# EAGLE design mega (EAGLE 9.2.2)
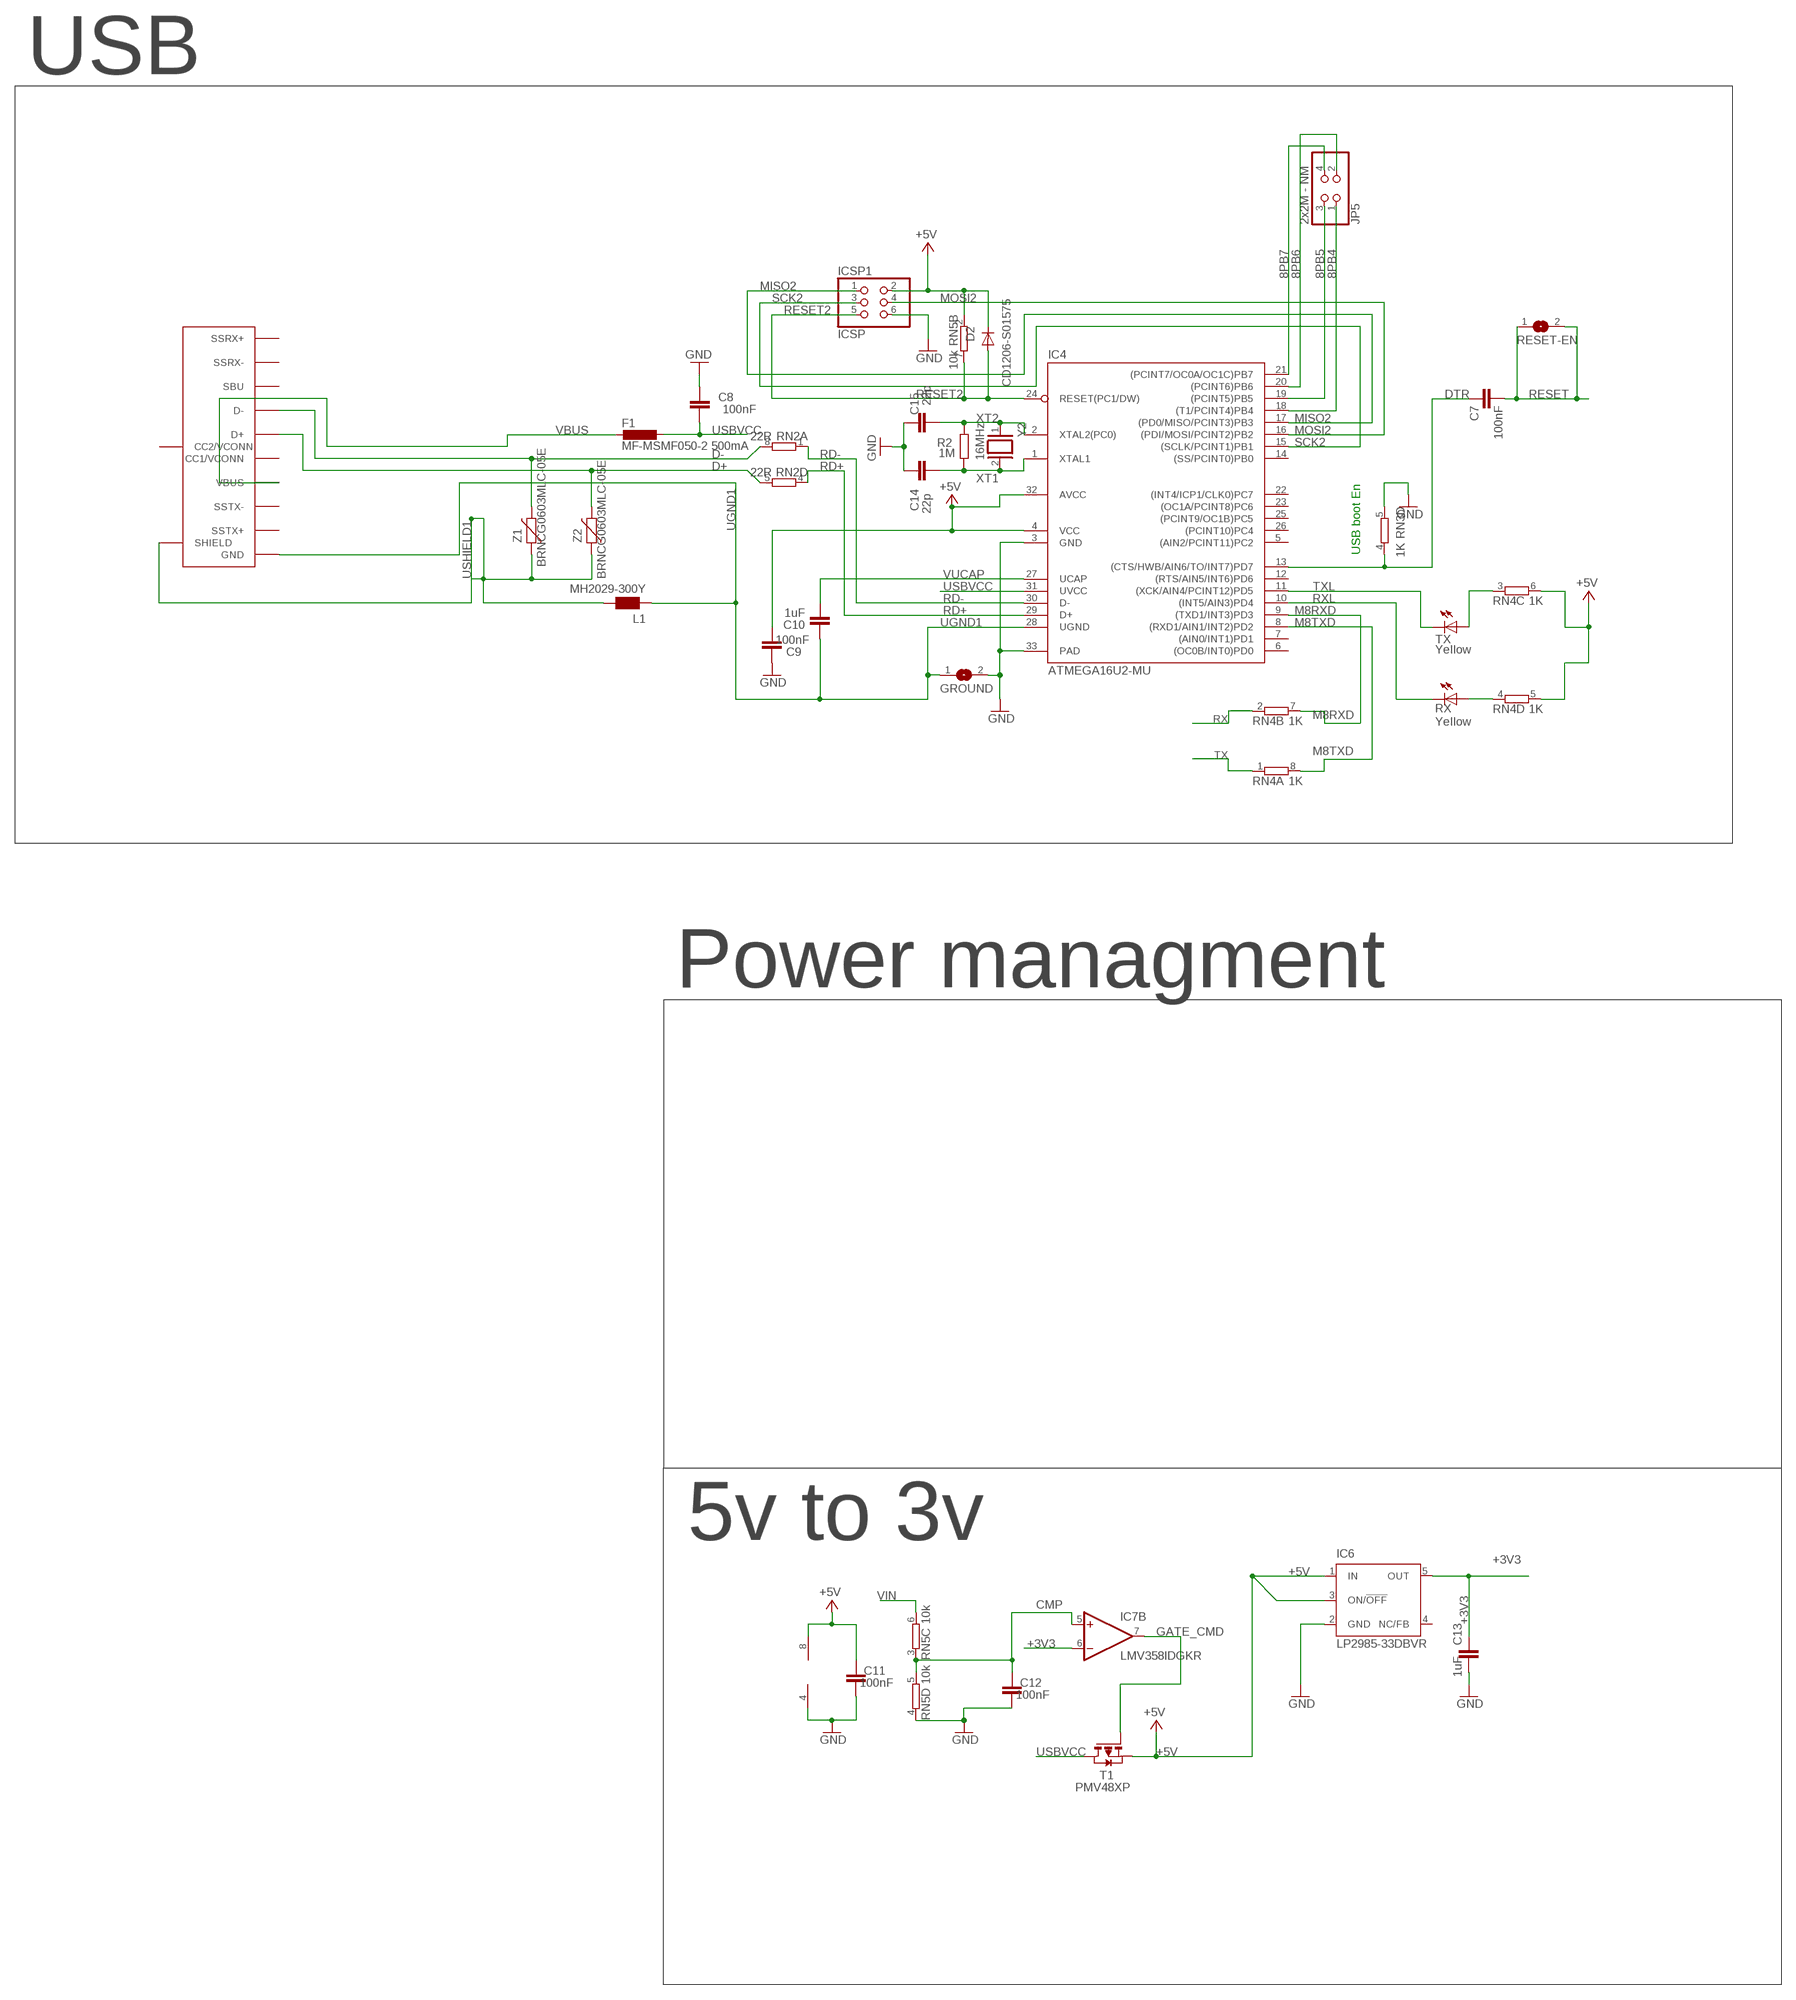
[diagram p0: schematic, sheet 1, part 1 of 2]
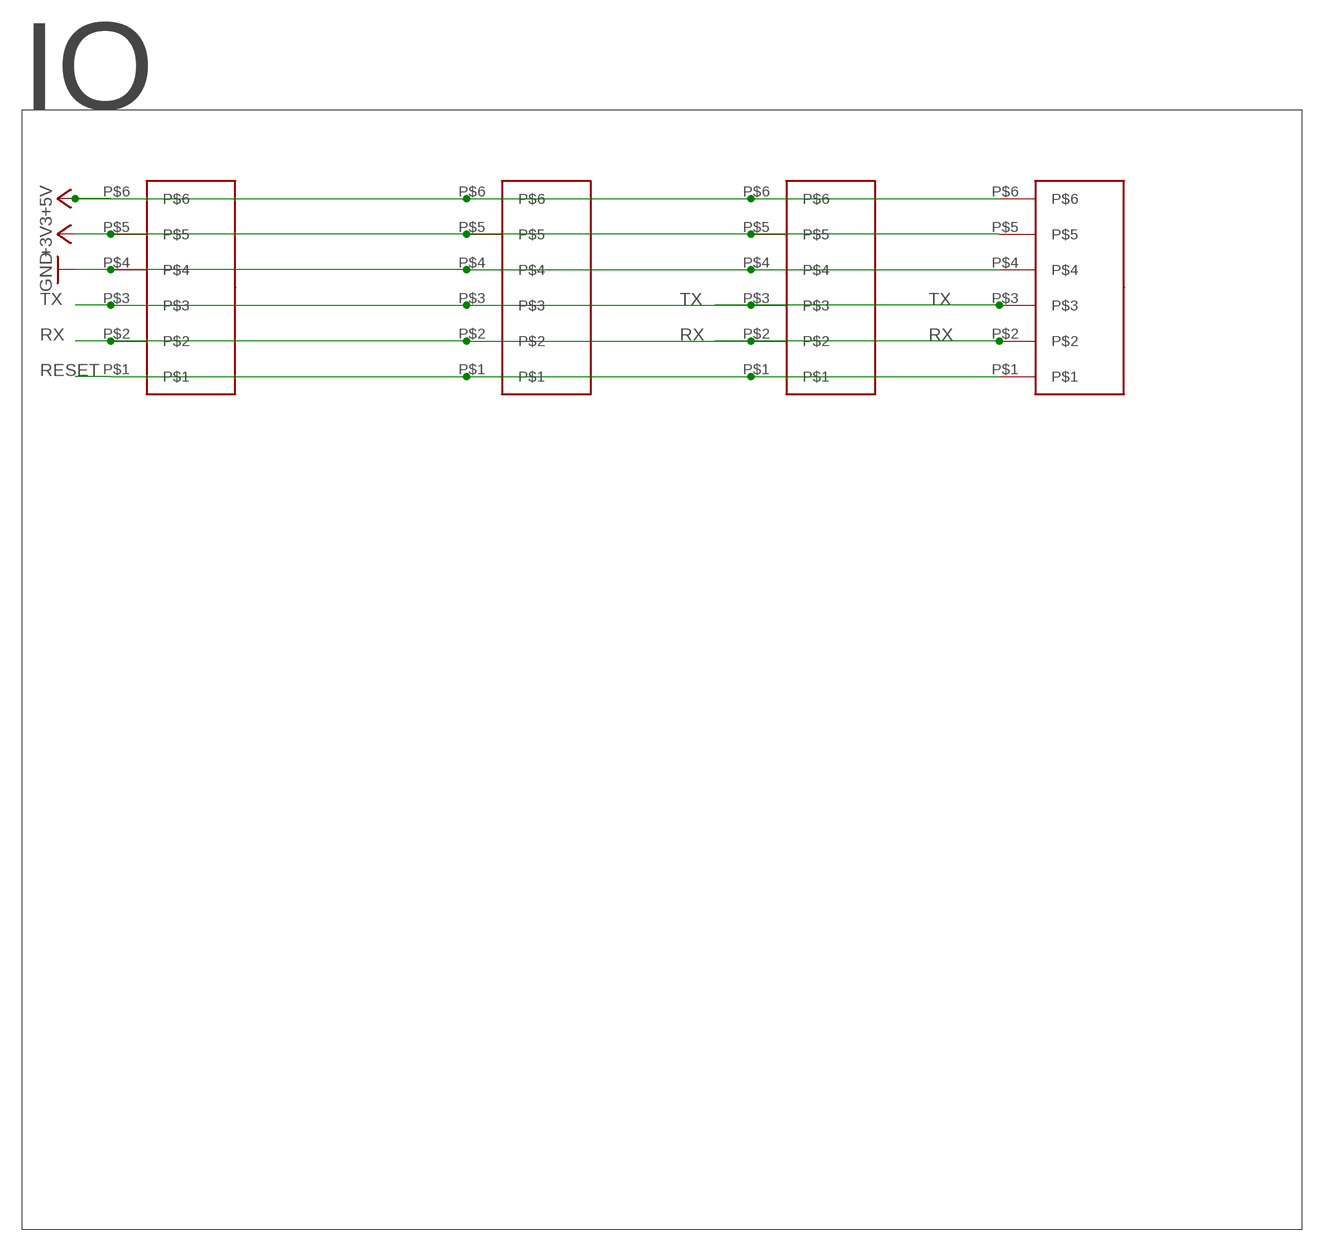
[diagram p1: schematic, sheet 1, part 2 of 2]

## Parts
C7  100nF  0015_100NF_0603  [C0603-ROUND]
C8  100nF  0015_100NF_0603  [C0603-ROUND]
C9  100nF  0015_100NF_0603  [C0603-ROUND]
C10  1uF  0006_1UF_0603/GRM188R61E105KA12D  [C0603-ROUND]
C11  100nF  0015_100NF_0603  [C0603-ROUND]
C12  100nF  0015_100NF_0603  [C0603-ROUND]
C13  1uF  0006_1UF_0603/GRM188R61E105KA12D  [C0603-ROUND]
C14  22p  0014_22PF_0603  [C0603-ROUND]
C15  22p  0014_22PF_0603  [C0603-ROUND]
D2  CD1206-S01575  0012_CD1206-S01575  [MINIMELF]
F1  MF-MSMF050-2 500mA  0002_MF-MSMF050-2  [L1812]
GROUND  SJ  [SJ]
IC4  ATMEGA16U2-MU  0007_ATMEGA16U2-MUR  [MLF32]
IC6  LP2985-33DBVR  0008_TEXLP2985-33DBVR  [SOT23-DBV]
IC7  LMV358IDGKR  0021_LMV358IDGKR  [MSOP08]
ICSP1  ICSP  0114_PH254-203DF118A00V  [2X03]
JP5  2x2M - NM  PINHD-2X2  [2X02]
L1  MH2029-300Y  0001_BLM21PG300SN1D_/_MH2029-300Y  [0805]
R2  1M  0004_0603_1M  [R0603-ROUND]
RESET-EN  SJ  [SJ]
RN2  22R  0003_064R_22R_/_CAY16-220J4LF  [CAY16]
RN3  1K  0005_064R_1K_/_CAY16-102J4LF  [CAY16]
RN4  1K  0005_064R_1K_/_CAY16-102J4LF  [CAY16]
RN5  10k  0016_064R_10K_/_CAY16-103J4LF  [CAY16]
RX  Yellow  0044_KPT-2012YC  [CHIPLED_0805]
T1  PMV48XP  0297_PMV48XP  [SOT-23]
TX  Yellow  0044_KPT-2012YC  [CHIPLED_0805]
U$1  USB-TYPE-C  [USB-TYPE-C-SMT]
U$2  6PINHERM  [6PINHERMSMD]
U$3  6PINHERM  [6PINHERMSMD]
U$4  6PINHERM  [6PINHERMSMD]
U$5  6PINHERM  [6PINHERMSMD]
Y2  16MHz  0019_P011052006_16M  [QS]
Z1  BRNCG0603MLC-05E  0010_BRNCG0603MLC-05E  [CT/CN0603]
Z2  BRNCG0603MLC-05E  0010_BRNCG0603MLC-05E  [CT/CN0603]

## Nets
8PB4: IC4.18((T1/PCINT4)PB4) JP5.1
8PB5: IC4.19((PCINT5)PB5) JP5.3
8PB6: IC4.20((PCINT6)PB6) JP5.2
8PB7: IC4.21((PCINT7/OC0A/OC1C)PB7) JP5.4
+3V3 [power]: C13.2 IC6.5(OUT) IC7.6(B:-IN) U$2.P$5 U$3.P$5 U$4.P$5 U$5.P$5
+5V [power usb]: C9.1 C11.2 D2.C IC4.4(VCC) IC4.32(AVCC) IC6.1(IN) IC6.3(ON/!OFF) IC7.8(P:V+) ICSP1.2 RN4.5 RN4.6 RN5.2 T1.2(S) U$2.P$6 U$3.P$6 U$4.P$6 U$5.P$6
CMP: C12.2 IC7.5(B:+IN) RN5.3 RN5.5
D+: RN2.5 U$1.6(D+) U$1.B6(D+) Z2.2
D-: RN2.8 U$1.7(D-) U$1.B7(D-) Z1.2
DTR: C7.1 IC4.13((CTS/HWB/AIN6/TO/INT7)PD7) RN3.4
GATE_CMD: IC7.7(B:OUT) T1.3(G)
GND [gnd]: C8.2 C9.2 C11.1 C12.1 C13.1 C14.2 C15.2 GROUND.2 IC4.3(GND) IC4.33(PAD) IC6.2(GND) IC7.4(P:V-) ICSP1.6 RN3.5 RN5.4 U$2.P$4 U$3.P$4 U$4.P$4 U$5.P$4
M8RXD: IC4.9((TXD1/INT3)PD3) RN4.7
M8TXD: IC4.8((RXD1/AIN1/INT2)PD2) RN4.8
MISO2: IC4.17((PD0/MISO/PCINT3)PB3) ICSP1.1
MOSI2: IC4.16((PDI/MOSI/PCINT2)PB2) ICSP1.4
N$54: RN4.4 RX.A
N$55: RN4.3 TX.A
RD+: IC4.29(D+) RN2.4
RD-: IC4.30(D-) RN2.1
RESET: C7.2 RESET-EN.1 RESET-EN.2 U$2.P$1 U$3.P$1 U$4.P$1 U$5.P$1
RESET2: D2.A IC4.24(RESET(PC1/DW)) ICSP1.5 RN5.7
RX: RN4.2 U$2.P$2 U$3.P$2 U$4.P$2 U$5.P$2
RXL: IC4.10((INT5/AIN3)PD4) RX.C
SCK2: IC4.15((SCLK/PCINT1)PB1) ICSP1.3
TX: RN4.1 U$2.P$3 U$3.P$3 U$4.P$3 U$5.P$3
TXL: IC4.11((XCK/AIN4/PCINT12)PD5) TX.C
UGND1 [gnd]: C10.2 GROUND.1 IC4.28(UGND) L1.1 U$1.1(GND) U$1.12(GND) U$1.B1(GND) U$1.B12(GND)
USBVCC [power usb]: C8.1 F1.1 IC4.31(UVCC) T1.1(D)
USHIELD1 [gnd]: L1.2 U$1.P$1(SHIELD) U$1.P$2(SHIELD) U$1.P$3(SHIELD) U$1.P$4(SHIELD) U$1.P$5(SHIELD) U$1.P$6(SHIELD) U$1.P$7(SHIELD) U$1.P$8(SHIELD) U$1.P$9(SHIELD) U$1.P$10(SHIELD) U$1.P$11(SHIELD) U$1.P$12(SHIELD) U$1.P$13(SHIELD) U$1.P$14(SHIELD) U$1.P$15(SHIELD) U$1.P$16(SHIELD) U$1.P$17(SHIELD) U$1.P$18(SHIELD) U$1.P$19(SHIELD) U$1.P$20(SHIELD) U$1.P$21(SHIELD) U$1.P$22(SHIELD) U$1.P$23(SHIELD) U$1.P$24(SHIELD) U$1.P$25(SHIELD) U$1.P$26(SHIELD) U$1.P$27(SHIELD) U$1.P$28(SHIELD) Z1.1 Z2.1
VBUS [power usb]: F1.2 U$1.4(VBUS) U$1.9(VBUS) U$1.B4(VBUS) U$1.B9(VBUS)
VIN [power]: RN5.6
VUCAP: C10.1 IC4.27(UCAP)
XT1: C14.1 IC4.1(XTAL1) R2.1 Y2.2
XT2: C15.1 IC4.2(XTAL2(PC0)) R2.2 Y2.1
Unconnected: IC4.5((AIN2/PCINT11)PC2) IC4.6((OC0B/INT0)PD0) IC4.7((AIN0/INT1)PD1) IC4.12((RTS/AIN5/INT6)PD6) IC4.14((SS/PCINT0)PB0) IC4.22((INT4/ICP1/CLK0)PC7) IC4.23((OC1A/PCINT8)PC6) IC4.25((PCINT9/OC1B)PC5) IC4.26((PCINT10)PC4) IC6.4(NC/FB) IC7.1(A:OUT) IC7.2(A:-IN) IC7.3(A:+IN) RN2.2 RN2.3 RN2.6 RN2.7 RN3.1 RN3.2 RN3.3 RN3.6 RN3.7 RN3.8 RN5.1 RN5.8 U$1.2(SSTX+) U$1.3(SSTX-) U$1.5(CC1/VCONN) U$1.8(SBU) U$1.10(SSRX-) U$1.11(SSRX+) U$1.B2(SSTX+) U$1.B3(SSTX-) U$1.B5(CC2/VCONN) U$1.B8(SBU) U$1.B10(SSRX-) U$1.B11(SSRX+)

## Notes on the sheet
- USB | IO
- USB boot En
- Power managment
- 5v to 3v

## Library data of the parts
C7-C9 C11 C12 = Condensatori:0015_100NF_0603: 100nF 0603 50V; CASE: 0603; MONTHLY_USAGE: _____; PART_NUMBER: cl10b104kbnc; PRICE: _____; SUPPLIER: _____; TYPE: Condensatori
C10 C13 = Condensatori:0006_1UF_0603/GRM188R61E105KA12D: 1uF 0603; CASE: 0603; MONTHLY_USAGE: _____; PART_NUMBER: 1uF_0603/GRM188R61E105KA12D; PRICE: _____; SUPPLIER: _____; TYPE: Condensatori
C14 C15 = Condensatori:0014_22PF_0603: 22pF 0603; CASE: 0603; MONTHLY_USAGE: _____; PART_NUMBER: 22pF_0603; PRICE: _____; SUPPLIER: _____; TYPE: Condensatori
D2 = Diodi:0012_CD1206-S01575: small-signal high-speed Switching Diodes CD1206; CASE: 1206; MONTHLY_USAGE: _____; PART_NUMBER: CD1206-S01575; PRICE: _____; SUPPLIER: _____; TYPE: Diodi
F1 = Protezione:0002_MF-MSMF050-2: 500 mA Multifuse � Polyfuse; MONTHLY_USAGE: _____; PART_NUMBER: MF-MSMF050-2; PRICE: _____; SUPPLIER: _____; TYPE: Protezione
GROUND RESET-EN = jumper:SJ: SMD solder JUMPER
IC4 = IntegratedCircuits:0007_ATMEGA16U2-MUR: 8-bit Microcontroller with 16K Bytes of ISP Flash and USB Controller ATMEGA16U2-MUR; CASE: QFN32_5x5; MONTHLY_USAGE: _____; PART_NUMBER: ATMEGA16U2-MUR; PRICE: _____; SUPPLIER: _____; TYPE: Circuito_Integrato
IC6 = IntegratedCircuits:0008_TEXLP2985-33DBVR: 150-mA LOW-NOISE LOW-DROPOUT REGULATOR WITH SHUTDOWN LP2985-33DBVR; CASE: SOT23-5; MONTHLY_USAGE: _____; PART_NUMBER: TEXLP2985-33DBVR; PRICE: _____; SUPPLIER: _____; TYPE: Circuito_Integrato
IC7 = IntegratedCircuits:0021_LMV358IDGKR: Dual low-voltage (2.7 V to 5.5 V), operational amplifiers with rail-to-rail output swing LMV358IDGKR; CASE: MSOP8; MONTHLY_USAGE: _____; PART_NUMBER: LMV358IDGKR; PRICE: _____; SUPPLIER: _____; TYPE: Circuito_Integrato
ICSP1 = Connettori:0114_PH254-203DF118A00V: 3x2 M V h 8,5 mm p2,54; MONTHLY_USAGE: _____; PART_NUMBER: PH254-203DF118A00V; PRICE: _____; SUPPLIER: _____; TYPE: Connettori
JP5 = SmartPrj:PINHD-2X2: PIN HEADER
L1 = Protezione:0001_BLM21PG300SN1D_/_MH2029-300Y: BLM21; MONTHLY_USAGE: _____; PART_NUMBER: BLM21PG300SN1D_/_MH2029-300Y; PRICE: _____; SUPPLIER: _____; TYPE: Protezione
R2 = Resistenze:0004_0603_1M: 1M 0603; CASE: 0603; MONTHLY_USAGE: _____; PART_NUMBER: 0603_1M; PRICE: _____; SUPPLIER: _____; TYPE: Resistenze
RN2 = Resistenze:0003_064R_22R_/_CAY16-220J4LF: 22R 064R; CASE: SMD_3,2x1,6; MONTHLY_USAGE: _____; PART_NUMBER: 064R_22R_/_CAY16-220J4LF; PRICE: _____; SUPPLIER: _____; TYPE: Resistenze
RN3 RN4 = Resistenze:0005_064R_1K_/_CAY16-102J4LF: 1K 064R; CASE: SMD_3,2x1,6; MONTHLY_USAGE: _____; PART_NUMBER: 064R_1K_/_CAY16-102J4LF; PRICE: _____; SUPPLIER: _____; TYPE: Resistenze
RN5 = Resistenze:0016_064R_10K_/_CAY16-103J4LF: 10K 064 R; CASE: SMD_3,2x1,6; MONTHLY_USAGE: _____; PART_NUMBER: 064R_10K_/_CAY16-103J4LF; PRICE: _____; SUPPLIER: _____; TYPE: Resistenze
RX TX = Opto:0044_KPT-2012YC: LED YELLOW - SMD - 0805; MONTHLY_USAGE: _____; PART_NUMBER: KPT-2012YC; PRICE: _____; SUPPLIER: _____; TYPE: Opto
T1 = Transistors:0297_PMV48XP: 20 V, 3.5 A P-channel Trench MOSFET - PMV48XP; CASE: SOT23; MONTHLY_USAGE: _____; PART_NUMBER: PMV48XP; PRICE: _____; SUPPLIER: _____; TYPE: Transistor
U$1 = lio:USB-TYPE-C
U$2-U$5 = te_conectivity_6_pin_herm:6PINHERM: https://www.mouser.com/ProductDetail/TE-Connectivity/2213611-3?qs=sGAEpiMZZMsg%252bek5lc7F5uB08Utn55q4E3YUmFQRoIY%3d
Y2 = Cristalli:0019_P011052006_16M: 16MHz THT; PART_NUMBER: P011052006 16M/FTX16M20S; TYPE: Cristalli
Z1 Z2 = Protezione:0010_BRNCG0603MLC-05E: CG0603MLC-05E; MONTHLY_USAGE: _____; PART_NUMBER: BRNCG0603MLC-05E; PRICE: _____; SUPPLIER: _____; TYPE: Protezione

## Net classes
0 default: width 0.203 mm, drill 0.406 mm, clearance 0.203 mm
1 power: width 0.61 mm, drill 0.406 mm, clearance 0.203 mm
2 gnd: width 0.305 mm, drill 0.406 mm, clearance 0.203 mm
3 power usb: width 0.508 mm, drill 0.406 mm, clearance 0.203 mm

## Board
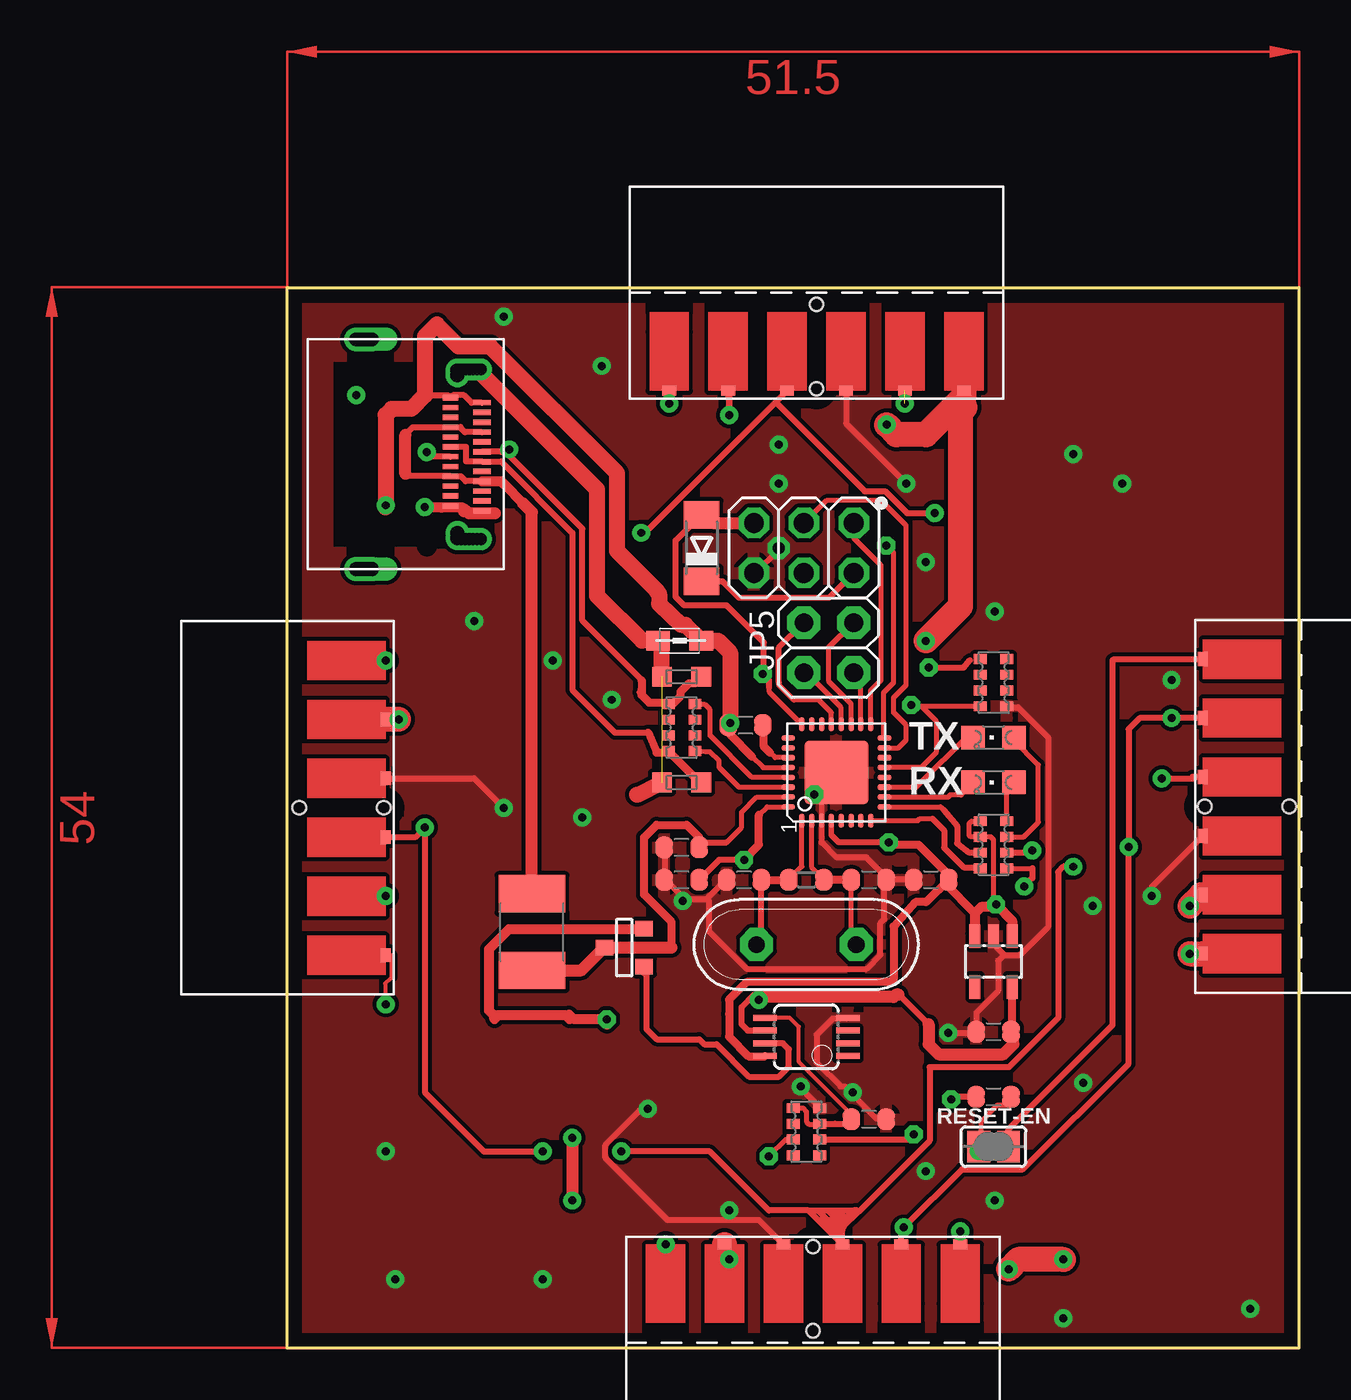
[diagram p2: board, top side]
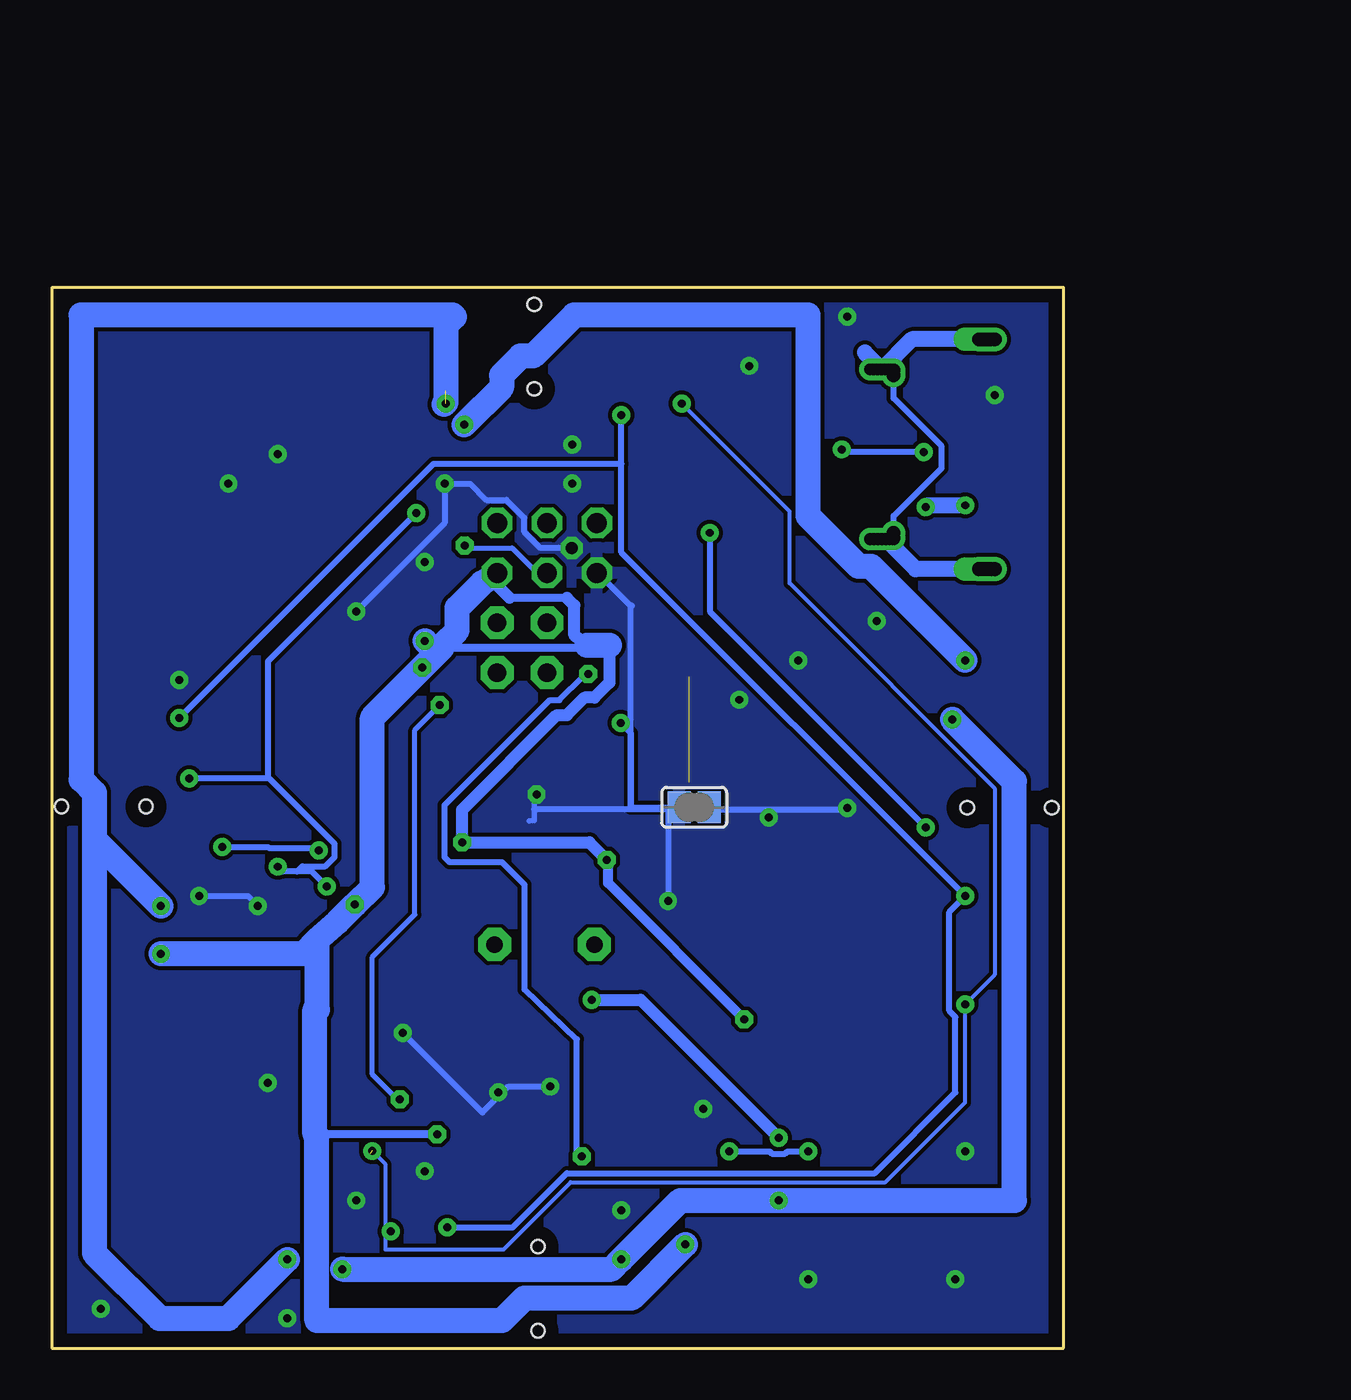
[diagram p3: board, bottom side, seen from below]

Size 51.5 x 54 mm. Coordinates in mm from the lower left corner, seen from the top.
Outline: 0,54 51.5,54 51.5,0 0,0 0,54
Copper layers (1*16): Top 0.035mm / dielectric 1.5mm / Bottom 0.035mm
Design rules "ArduinoMega *": minimum track width 8mil, minimum drill 16mil, track to track 7mil, track to pad 7mil, pad to pad 8mil, via to via 10mil, smd to smd 7mil, copper to edge 27mil, drill to drill 12mil, minimum pad ring 10mil, minimum via ring 10mil, stop-mask expansion 2mil, vias tented up to drill 24mil, thermal gap 10mil

### Footprints (pad centres in the part's own frame; a part is rotated, then mirrored left to right if it is on the bottom)
C0603-ROUND = smd 0.898 x 1.1: 1 -0.889,0; 2 0.889,0
MINIMELF = smd 1.4 x 1.8: A 1.7,0; C -1.7,0
L1812 = smd 1.9 x 3.4: 1 -1.95,0; 2 1.95,0
SJ = smd 1.168 x 1.6: 1 -0.762,0; 2 0.762,0
MLF32 = smd 0.7 x 0.28: 1 -2.45,1.75; 2 -2.45,1.25; 3 -2.45,0.75; 4 -2.45,0.25; 5 -2.45,-0.25; 6 -2.45,-0.75; 7 -2.45,-1.25; 8 -2.45,-1.75; 17 2.45,-1.75; 18 2.45,-1.25; 19 2.45,-0.75; 20 2.45,-0.25; 21 2.45,0.25; 22 2.45,0.75; 23 2.45,1.25; 24 2.45,1.75 | smd 0.28 x 0.7: 9 -1.75,-2.45; 10 -1.25,-2.45; 11 -0.75,-2.45; 12 -0.25,-2.45; 13 0.25,-2.45; 14 0.75,-2.45; 15 1.25,-2.45; 16 1.75,-2.45; 25 1.75,2.45; 26 1.25,2.45; 27 0.75,2.45; 28 0.25,2.45; 29 -0.25,2.45; 30 -0.75,2.45; 31 -1.25,2.45; 32 -1.75,2.45 | smd 3.254 x 3.254: 33 0,0
SOT23-DBV = smd 0.55 x 1.2: 1 -0.95,-1.3; 2 0,-1.3; 3 0.95,-1.3; 4 0.95,1.3; 5 -0.95,1.3
MSOP08 = smd 0.3 x 1.2: 1 -0.976,-2.113; 2 -0.326,-2.113; 3 0.324,-2.113; 4 0.974,-2.113; 5 0.974,2.112; 6 0.324,2.112; 7 -0.326,2.112; 8 -0.976,2.112
2X03 = drill 1.016 pad 1.55 octagon: 1 -2.54,-1.27; 2 -2.54,1.27; 3 0,-1.27; 4 0,1.27; 5 2.54,-1.27; 6 2.54,1.27
2X02 = drill 0.95 pad 1.676 octagon: 1 -1.27,-1.27; 2 -1.27,1.27; 3 1.27,-1.27; 4 1.27,1.27
0805 = smd 1.2 x 1: 1 -1.1,0; 2 1.1,0
R0603-ROUND = smd 0.898 x 1.1: 1 -0.889,0; 2 0.889,0
CAY16 = smd 0.5 x 0.65: 1 -1.2,-0.675; 2 -0.4,-0.675; 3 0.4,-0.675; 4 1.2,-0.675; 5 1.2,0.675; 6 0.4,0.675; 7 -0.4,0.675; 8 -1.2,0.675
CHIPLED_0805 = smd 1.2 x 1.2: A 0,-1.05; C 0,1.05
SOT-23 = smd 0.787 x 0.889: 1 0.025,-1.016; 2 -0.94,1.016; 3 0.991,1.016
USB-TYPE-C-SMT = smd 0.27 x 0.9: 1 -2.625,0.7; 2 -2.125,0.7; 3 -1.625,0.7; 4 -1.125,0.7; 5 -0.625,0.7; 6 -0.125,0.7; 7 0.375,0.7; 8 0.875,0.7; 9 1.375,0.7; 10 1.875,0.7; 11 2.375,0.7; 12 2.875,0.7 | smd 0.27 x 0.8: B1 2.625,-0.9; B2 2.125,-0.9; B3 1.625,-0.9; B4 1.125,-0.9; B5 0.625,-0.9; B6 0.125,-0.9; B7 -0.375,-0.9; B8 -0.875,-0.9; B9 -1.375,-0.9; B10 -1.875,-0.9; B11 -2.375,-0.9; B12 -2.875,-0.9 | drill 0.6: P$1 -4.32,0.25; P$2 4.32,0.65; P$3 -4.32,0.65; P$4 -4.32,0.45; P$7 -4.32,-0.35; P$8 -4.32,0.05; P$9 -4.32,-0.15; P$10 4.32,0.45; P$11 4.32,0.25; P$12 4.32,0.05; P$13 4.32,-0.15; P$14 4.32,-0.35 | drill 0.7 offset: P$5 5.85,-5.4; P$23 -5.85,-5.4 | drill 0.7: P$6 -5.85,-5.3; P$15 4.27,-0.55; P$16 -4.02,-0.55; P$17 -4.27,-0.55; P$18 4.02,-0.55; P$19 -5.85,-5.7; P$20 -5.85,-5.5; P$21 -5.85,-5.1; P$22 -5.85,-4.9; P$24 5.85,-5.7; P$25 5.85,-5.5; P$26 5.85,-5.3; P$27 5.85,-5.1; P$28 5.85,-4.9
6PINHERMSMD = smd 0.5 x 0.7: P$1 -5,17; P$2 -5,14; P$3 -5,11; P$4 -5,8; P$5 -5,5; P$6 -5,2 | hole 0.65: -4.9,9.5; -0.6,9.5 | hole 0.7: -4.9,9.5; -0.6,9.5
QS = drill 0.85 pad 1.676 octagon: 1 -2.54,0; 2 2.54,0
CT/CN0603 = smd 1 x 1: 1 -1,0; 2 1,0

### Placement (x,y rotation side)
C7  35.95,12.8 0 top
C8  20.08,25.5 180 top
C9  20.08,23.85 180 top
C10  23.33,31.72 180 top
C11  32.78,23.85 0 top
C12  29.6,11.66 180 top
C13  35.95,16.1 0 top
C14  23.25,23.85 180 top
C15  29.6,23.85 0 top
D2  21.1,40.74 90 top
F1  12.46,21.18 90 top
GROUND  18.81,27.53 180 bottom
IC4  27.95,29.31 90 top
IC6  35.95,19.68 180 top
IC7  26.43,15.85 90 top
ICSP1  26.3,40.74 180 top
JP5  27.57,35.66 90 top
L1  19.98,36.02 180 top
R2  26.43,23.85 0 top
RESET-EN  35.95,10.26 0 top
RN2  20.08,31.6 90 top
RN3  35.95,33.88 270 top
RN4  35.95,25.63 90 top
RN5  26.43,11.02 90 top
RX  35.95,28.8 90 top
T1  17.16,20.42 270 top
TX  35.95,31.09 90 top
U$1  9.21,45.51 270 top
U$2  36.45,53.75 90 top
U$3  0.01,37.01 180 top
U$4  51.61,18.08 0 top
U$5  17.26,0.28 270 top
Y2  26.43,20.55 180 top
Z1  20.08,28.8 0 top
Z2  20.08,34.19 0 top

### Tracks (layer width: path | path; a pad name or v marks a point on that pad's centre or on a via)
8PB4
  Top 0.254: 28.59,34.39 JP5.1 29.2,34.03 IC4.18
8PB5
  Top 0.254: 27.57,35.66 27.57,33.93 28.7,32.8 IC4.19
  Top 0.305: 27.57,35.66 JP5.3
8PB6
  Top 0.254: IC4.20 28.2,32.62 26.43,34.39 JP5.2
8PB7
  Top 0.254: IC4.21 27.7,32.36 27.06,32.99 25.79,32.99 25.03,33.76 25.03,33.88
  Top 0.305: 25.03,33.88 25.03,35.66 JP5.4
+3V3  (via drill 0.41)  (2 unrouted)
  Top 0.305: IC7.6 23.44,16.17 23.13,16.48 23.13,17.37 23.76,18.01 31.13,18.01 32.65,16.48
  Top 0.406: 36.9,16.13 IC6.5
  Top 0.61: 36.9,16.13 C13.2 36.97,16.06 36.97,15.47 36.46,14.96 33.16,14.96 32.65,15.47 32.65,16.48 | 31.13,18.01 30.99,18.01 30.86,17.87 24.15,17.87 v24.01,17.73 | v14.51,10.71 v14.51,7.51
  Top 1.27: v45.95,22.51 46.52,23.08 U$4.P$5 | v39.51,4.51 37.22,4.51 v36.72,4.01 | v22.51,4.51 22.26,4.76 U$5.P$5 | v5.67,32.01 U$3.P$5
  Bottom 0.61: v24.01,17.73 21.53,17.73 v14.51,10.71
  Bottom 1.27: 31.56,48.05 31.45,48.16 31.45,52.08 31.01,52.51 31.11,52.6 50.01,52.6 50.01,28.95 49.34,28.27 49.34,25.9 | 49.34,25.9 v45.95,22.51 | 49.34,25.9 49.34,4.84 46.01,1.51 42.51,1.51 v39.51,4.51 | v36.72,4.01 23.01,4.01 v22.51,4.51 19.51,7.51 v14.51,7.51 2.51,7.51 2.51,28.85 v5.67,32.01
  other vias: 31.45,48.09
+5V  (via drill 0.41)
  Top 0.254: v36.08,22.58 36.02,22.71 35.95,23.15 35.95,25.88 35.81,26.03 RN4.6 34.8,26.03 34.71,26.11 34.71,26.71 34.83,26.83 RN4.5 | IC4.32 24.43,27.56 24.02,27.15
  Top 0.279: IC4.4 27.7,26.13 28.08,25.75
  Top 0.305: v32.65,34.64 34.43,34.64 34.75,35.02 | C9.1 21.98,24.87 v23.25,24.87 | RN5.2 31.62,10.62 v31.89,10.89 | v30.62,25.75 28.08,25.75 | D2.C 22.16,39.04 23,38.2 27.57,38.2 ICSP1.2
  Top 0.406: C11.2 33.54,23.6 35,22.14 | C11.2 33.67,24.1 32.14,25.63 30.75,25.63 v30.62,25.75 | C11.2 32.53,22.71 31.98,22.71 30.87,21.48 30.87,18.77 30.62,18.64 23.38,18.64 22.49,17.75 22.49,17.01 22.49,15.85 23.48,14.86 24.33,14.86 IC7.8 | 24.02,27.15 24.02,25.63 v23.25,24.87
  Top 0.508: 34.97,21.18 IC6.3 35,22.14 35.32,22.45 35.95,22.45 | IC6.1 36.9,21.76 v36.08,22.58 | 10.59,16.77 10.55,16.74 10.49,16.97 | 14.35,16.77 14.36,16.74 14.55,16.77 | 14.55,16.77 16.18,16.77 v16.27,16.74 16.28,16.46 | 10.49,16.97 10.29,17.18 10.29,20.32 11.3,21.34 17.8,21.34 T1.2 | 10.49,16.97 14.35,16.97 14.55,16.77
  Top 0.61: v36.08,22.58 35.95,22.45
  Top 0.813: 18.12,21.36 T1.2
  Top 1.27: v45.95,20.08 U$4.P$6 | v30.51,47.01 31.01,46.51 32.51,46.51 33.91,47.91 | 33.91,47.91 34.51,47.91 | U$2.P$6 34.45,48.44 34.26,48.26 | 34.26,48.26 33.91,47.91 | 34.26,48.26 34.26,37.76 v32.51,36.01
  Bottom 0.406: 31.51,35.66 24.78,35.66 24.65,35.79 24.27,35.79 | 25.29,38.2 28.21,38.2 | v31.89,10.89 38.11,10.89
  Bottom 0.508: v23.25,24.87 23.19,24.59 23.19,23.68 16.28,16.77 v16.27,16.74
  Bottom 0.61: 31.64,35.79 31.51,35.66 | 24.27,35.79 24.9,36.3 24.9,37.82 25.29,38.2 | 28.21,38.2 28.84,38.84 ICSP1.2 | v23.25,24.87 24.14,25.75 v30.62,25.75 30.62,27.41 25.79,32.23 25.29,32.23 24.4,33.12 23.89,33.12 23.13,33.88 23.13,35.79
  Bottom 1.27: 31.64,35.66 v32.65,34.64 35.19,32.1 35.19,23.47 v36.08,22.58 36.97,21.69 37.99,20.8 | ICSP1.2 28.97,39.34 29.6,38.96 30.87,37.69 30.87,36.55 31.64,35.79 31.64,35.66 | 37.99,20.8 37.99,17.25 38.11,17.25 38.11,10.89 38.01,10.8 38.01,1.4 28.6,1.4 27.45,2.55 21.99,2.55 U$5.P$6 | 24.27,35.79 23.13,35.79 | 37.99,20.8 38.71,20.08 v45.95,20.08 | U$3.P$6 9.8,39.8 10.44,39.8 13.01,42.38 13.01,52.6 24.92,52.6 27.01,50.52 27.64,50.52 28.62,49.54 28.62,48.91 v30.51,47.01 | v32.51,36.01 32.16,35.66 31.64,35.66
  other vias: 19.26,5.28 5.01,35.01
CMP
  Top 0.203: C12.2 28.71,11.91 26.05,14.58 26.05,16.36 25.58,16.82 IC7.5
  Top 0.254: 27.08,11.4 26.56,11.4 26.43,11.53 26.43,12.04 26.25,12.22 RN5.5
  Top 0.305: 27.08,11.4 RN5.3 | RN5.3 27.88,11.42 | C12.2 28.48,11.42 RN5.3
D+  (via drill 0.41)
  Top 0.305: 18.05,33.51 17.93,33.4 | U$1.6 10.89,45.64 11.01,45.76 v11.3,45.76 11.3,45.45 15.02,41.72 15.02,37.04 18.05,34.01 | U$1.B6 7.34,45.39 v7.11,45.61
  Top 0.406: 20.95,34.01 Z2.2 20.75,33.86 20.46,33.86 20.03,33.42 20.03,33.2 19.63,32.8 RN2.5 19.33,32.87 18.43,32.87 18.05,33.25 18.05,33.51 18.05,34.01
  Bottom 0.305: v7.11,45.61 11.15,45.61 v11.3,45.76
D-
  Top 0.305: U$1.B7 9.11,45.89 9.11,45.14 U$1.7 10.89,45.14 14.51,41.51 14.51,33.51 16.68,31.34 18.37,31.34
  Top 0.406: 18.37,31.34 18.81,30.33 19.33,30.33 RN2.8 20.74,29.06 Z1.2
DTR  (via drill 0.41)
  Top 0.254: 32.27,32.68 31.82,32.68 v31.76,32.74 | 32.27,32.68 RN3.4 | IC4.13 32.27,29.56 33.03,30.33 33.03,31.92 32.27,32.68
  Top 0.305: C7.1 34.05,12.8 v33.8,12.67
  Bottom 0.254: v33.8,12.67 33.92,12.67 35.19,13.94 35.19,19.91 33.03,22.07 33.03,31.47 v31.76,32.74
GATE_CMD
  Top 0.305: T1.3 18.3,19.3 18.3,16.23 18.81,15.72 20.97,15.72 21.22,15.47 21.86,15.47 23.51,13.82 25.03,13.82 25.54,14.32 25.54,15.21 25.23,15.52 IC7.7
  Top 0.406: T1.3 18.17,19.15
GND  (via drill 0.41, 0.61)
  Top 0.279: 27.2,25.74 IC4.3 | 27.2,27.84 27.2,27.87 27.2,27.88 27.2,26.81
  Top 0.305: v26.83,28.19 27.25,28.19 | C15.2 30.49,23.98 29.48,24.99 27.95,24.99 27.2,25.74 | IC4.33 27.95,27.84 v26.83,28.19 | v26.83,28.19 27.2,27.82 | 27.2,27.84 v26.83,28.19 | 36.5,20.02 37.31,20.02 38.73,21.44 38.73,31.09 37.21,32.62 36.7,32.62 RN3.5 | 36.5,20.02 35.99,20.53 35.99,20.93 IC6.2 | 36.5,20.02 36.19,19.71 36.19,18.19 35.08,17.07 35.08,16.16 C13.1 34.98,16.06 v33.66,16.06 | C11.1 31.83,23.88 30.61,23.88 C15.2 | C8.2 19.23,25.41 19.23,23.88 C9.2 19.33,23.78 20.24,22.87 | 21.36,22.87 22.28,23.78 C14.2 | 20.24,22.87 21.36,22.87 | C15.2 30.4,23.78 30.4,21.85 30.2,21.65 30.2,20.02 29.49,19.31 23.39,19.31 21.46,21.24 21.46,22.76 21.36,22.87 | v25.03,40.74 25.02,40.64 23.8,39.43 ICSP1.6 | v20.14,22.76 20.24,22.87 | 28.73,12.96 28.37,13.31 28.17,13.31 26.95,14.53 26.95,15.96 27.76,16.77 28.47,16.77 IC7.4 | 28.73,12.96 30,11.69 30.4,11.69 C12.1 | v26.14,13.31 26.14,13.21 27.05,12.3 RN5.4 | v28.78,13.01 28.73,12.96 | v11.01,27.51 9.51,29.01 U$3.P$4 | U$2.P$4 28.45,47.08 v31.51,44.01 | U$5.P$4 24.03,6.51 19.36,6.51 16.2,9.68 16.2,10.35 18.03,12.18 v18.35,12.18 | U$4.P$4 44.01,23.48 v44.01,23.01
  Bottom 0.279: 27.2,26.84 27.22,26.84 26.96,26.87 26.96,27.44 26.96,27.89
  Bottom 0.305: GROUND.2 18.17,27.53 | 26.96,27.89 26.85,27.95 26.85,28.15 v26.83,28.19 | 19.63,27.44 22.07,27.44 | 22.07,27.44 26.96,27.44 | 19.63,27.44 GROUND.2 | v25.03,40.74 25.12,40.75 26.64,40.75 27.46,41.56 27.46,42.27 28.37,43.19 29.39,43.19 30.21,44.01 v31.51,44.01 31.51,42.01 v36.01,37.51 | 22.07,37.8 22.07,27.44 | 22.07,37.8 23.7,39.43 ICSP1.6 | 21.97,37.8 22.07,37.8 | v20.14,22.76 20.14,27.34 GROUND.2 | v26.14,13.31 28.27,13.31 28.68,12.91 | 28.68,12.91 29.59,11.99 v33.66,16.06 | v28.78,13.01 28.68,12.91 | 19.63,27.44 11.09,27.44 v11.01,27.51 | v44.01,23.01 41.51,23.01 v41.01,22.51
  other vias: 9.51,37.01 3.51,48.51 11.01,52.51 16.01,50.01 40.01,45.51 42.51,44.01 5.51,3.51 13.01,3.51 5.01,10.01 15.01,27.01 13.51,35.01 16.51,33.01 25.01,46.01 25.01,44.01 32.51,40.01 45.01,34.01 32.51,9.01 40.51,13.51 22.51,7.01 36.01,7.51 39.51,1.51 49.01,2.01
  pour Top: 0.01,54.01 51.51,54.01 51.51,0.01 0.01,0.01
  pour Bottom: 0.01,0.01 51.51,0.01 51.51,54.01 0.01,54.01
M8RXD
  Top 0.254: 35.26,25.25 RN4.7 | IC4.9 33.26,27.56 33.41,27.41
  Top 0.305: 35.26,25.25 34.68,25.25 34.1,25.7 34.1,26.59 33.41,27.41
M8TXD
  Top 0.254: 32.84,26.96 32.21,26.96 32.11,26.86 IC4.8
  Top 0.305: 32.84,26.96 33.44,26.36 33.44,25.47 34.43,24.48 35.22,24.48 RN4.8
MISO2
  Top 0.254: IC4.17 29.7,33.47 30.24,34.01 30.24,39.85 28.84,41.25 ICSP1.1
MOSI2  (via drill 0.41)
  Top 0.254: v30.49,40.87 30.87,40.49 30.87,33.88 30.37,33.37 30.37,31.21 30.4,31.12 IC4.16
  Bottom 0.254: ICSP1.4 26.81,39.47 28.08,40.74 30.24,40.74 30.37,40.87 v30.49,40.87
N$54
  Top 0.254: RN4.4 36.63,28.33 RX.A
N$55
  Top 0.254: RN4.3 37.5,26.03 38.24,26.77 38.24,29.69 37,30.93 TX.A
RD+
  Top 0.254: IC4.29 23.66,29.06 21.53,31.19 21.53,32.51 21.27,32.76 20.79,32.76 RN2.4
RD-
  Top 0.254: RN2.1 21.29,30.37 21.51,30.37 21.98,29.9 21.98,29.56 22.99,28.56 IC4.30
RESET  (via drill 0.41)  (1 unrouted)
  Top 0.203: v5.01,17.51 5.01,18.51 4.98,18.55 5.32,18.89 5.32,20.01 U$3.P$1 | 19.45,48.44 v19.45,48.09 U$2.P$1 | 34.26,5.58 v34.26,5.94 U$5.P$1
  Top 0.254: 36.8,12.38 36.17,12.38 35.32,11.53 35.32,10.39 RESET-EN.1
  Top 0.305: 36.8,12.38 C7.2 | RESET-EN.1 RESET-EN.2 36.72,11.15 42.01,16.45 42.01,35.01 42.08,35.08 U$4.P$1 | RESET-EN.1 35.32,9.88 | 34.75,9.82 RESET-EN.1
  Bottom 0.203: v19.45,48.09 13.95,42.59 13.95,38.94 3.51,28.5 3.51,19.01 v5.01,17.51 5.01,12.51 9.07,8.45 25.1,8.45 28.54,5.01 34.51,5.01 34.51,6.01 | 34.51,6.01 34.51,9.35 v35.19,10.03 | 34.51,6.01 34.44,5.94 v34.26,5.94
RESET2  (via drill 0.41)
  Top 0.254: IC4.24 24.52,33.44 24.52,33.63 | RN5.7 25.39,10.62 v24.52,9.75
  Top 0.305: ICSP1.5 23,42.01 | v24.52,9.75 24.59,9.82 | 24.52,33.63 24.52,34.01 v24.21,34.33 24.27,34.26 24.27,35.91 22.36,37.82 20.21,37.82 19.77,38.25 19.77,41.12 D2.A
  Top 0.61: D2.A 21.65,42.01 ICSP1.5
  Bottom 0.305: v24.52,9.75 24.78,9.75 24.78,15.72 27.44,18.26 27.44,23.59 28.59,24.74 31.25,24.74 31.51,24.99 31.51,27.64 26.16,32.99 25.67,32.99 24.46,34.2 v24.21,34.33
RX  (via drill 0.41)
  Top 0.305: RN4.2 37.81,25.23 v37.92,25.34 | U$4.P$2 v45.01,32.08 43.39,32.08 42.83,31.51 v42.83,25.51 42.83,14.48 37.45,9.1 34.35,9.1 v31.39,6.14 31.26,6.01 U$5.P$2 | 22.45,48.39 22.51,48.32 v22.51,47.51 22.51,48.68 U$2.P$2
  Bottom 0.203: 38.05,25.47 v37.92,25.34
  Bottom 0.305: v42.83,25.51 40.51,25.51 40.47,25.47 38.05,25.47 | 22.51,45.01 22.51,40.51 U$3.P$2 5.83,22.2 5.83,17.18 5.51,16.86 5.51,13.01 9.62,8.91 25.28,8.91 28.05,6.14 v31.39,6.14 | 22.51,45.01 v22.51,47.51 | 22.51,45.01 32.08,45.01 v45.01,32.08
  other vias: 5.01,23.01
RXL
  Top 0.254: 34.29,28.19 33.78,28.19 33.65,28.06 IC4.10
  Top 0.305: 34.29,28.19 RX.C
SCK2
  Top 0.254: ICSP1.3 27.44,43.15 30.24,43.15 31.51,41.88 31.51,33.76 30.87,33.12 30.87,32.36 31.51,31.72 31.51,30.96 31.11,30.56 IC4.15
TX  (via drill 0.41)
  Top 0.254: RN4.1 37.93,24.43
  Top 0.305: 37.93,24.43 37.93,23.93 v37.51,23.51 | v40.01,24.51 39.51,24.51 39.24,24.24 39.24,16.81 36.74,14.3 32.7,14.3 32.7,10.56 29.08,6.94 | 29.08,6.94 28.33,6.19 28.01,6.19 | v44.51,29.01 46.01,29.01 | 46.01,29.01 46.19,29.01 46.25,29.08 | U$4.P$3 46.08,29.08 46.01,29.01 | U$2.P$3 24.86,48.16 | 24.86,48.16 18.21,41.51 v18.01,41.51 | U$3.P$3 6.51,26.01 v7.01,26.51 7.01,13.01 10.01,10.01 v13.01,10.01 | 24.86,48.16 29.39,43.64 30.44,43.64 31.56,42.51 v32.97,42.51 | 27.03,6.51 U$5.P$3 28.26,6.01 28.16,6.01 28.02,5.88 | 27.03,6.51 26.53,7.01 | v17.01,10.01 21.51,10.01 24.51,7.01 26.53,7.01 | 28.02,5.88 28.02,5.63 27.99,5.63 27.43,6.19 | 27.31,6.31 27.43,6.19 | 27.43,6.19 28.01,6.19 | 26.53,7.01 27.01,7.01 | 27.01,7.01 27.51,7.01 | 27.51,7.01 28.01,7.01 | 28.01,7.01 28.83,7.01 | 29.08,6.94 29.01,7.01 28.83,7.01 | 28.83,7.01 28.43,6.6 | 28.43,6.6 28.01,6.19 | 28.01,7.01 28.01,6.51 | 28.01,6.51 28.01,6.19 | 28.43,6.6 28.01,7.01 | 28.01,6.51 27.51,6.51 | 27.51,6.51 27.03,6.51 | 27.01,7.01 27.51,6.51 | 28.43,6.6 27.93,6.6 27.51,7.01 | 27.51,6.51 28.02,6.01 28.02,5.88
  Bottom 0.305: v37.51,23.51 38.26,24.26 39.01,24.26 | 39.01,24.26 39.76,24.26 v40.01,24.51 | 39.01,24.26 38.75,24.53 37.58,24.53 37.11,25 37.11,25.68 40.45,29.01 40.51,29.01 | 40.51,29.01 v44.51,29.01 | v18.01,41.51 18.01,37.51 v7.01,26.51 | v32.97,42.51 40.51,34.97 40.51,29.01 | v17.01,10.01 14.96,10.01 14.85,9.9 14.18,9.9 14.07,10.01 v13.01,10.01
TXL
  Top 0.254: TX.C 34.81,31.34 32.03,28.56 IC4.11
UGND1  (via drill 0.41)
  Top 0.254: IC4.28 24.22,29.56 23.66,30.12
  Top 0.305: 7.01,48.51 8.19,48.51 U$1.B12 8.44,48.51 9.01,48.51 9.39,48.14 U$1.1 | U$1.12 9.89,42.61 9.01,42.61 8.74,42.89 U$1.B1 8.24,42.81
  Top 0.406: 23.66,30.12 22.59,31.19 22.59,31.57 C10.2
  Top 0.508: 9.25,42.5 8.95,42.8 7.87,42.8 | v7.01,42.81 8.24,42.81
  Top 0.61: 10.57,42.5 9.25,42.5 9.14,42.61 9.01,42.61
  Top 0.813: C10.2 v22.54,31.82 22.54,35.41 21.93,36.02 L1.1 20.26,36.83 20.05,36.83 18.94,37.89 18.94,38.4 18.83,38.51 18.83,38.56 16.8,40.59 16.8,44.54 10.35,51 8.73,51 7.62,52.11 7.01,51.51 7.01,48.51 6.31,47.81 5.31,47.81 5.01,47.51 v5.01,42.91 5.01,42.81
  Bottom 0.305: GROUND.1 18.07,27.51 22.01,27.51 22.01,31.3 v22.54,31.82
  Bottom 0.813: v5.01,42.91 6.91,42.91 v7.01,42.81
USBVCC
  Top 0.254: IC4.31 23.91,28.06 23.13,27.28 23.13,26.52 22.36,25.75
  Top 0.305: 22.36,25.75 21.22,25.75 C8.1
  Top 0.406: C8.1 20.97,26.01 20.33,26.64 18.81,26.64 18.17,26.01 18.17,23.09 19.57,21.69 19.57,20.39
  Top 0.61: 19.57,20.39 T1.1 14.98,19.23 F1.1
USHIELD1  (1 unrouted)
  Top 0.305: U$1.P$21 3.86,51.41 U$1.P$23 3.98,51.41 U$1.P$6 | U$1.P$12 9.27,41.25 U$1.P$11 | U$1.P$12 9.67,41.25 U$1.P$10 9.88,41.25 U$1.P$2 | U$1.P$12 8.76,41.25 U$1.P$15 8.76,41.45 U$1.P$18 9.06,41.25 U$1.P$13 8.86,41.25 U$1.P$14
  Top 0.406: L1.2 18.88,35.86
  Top 0.61: U$1.P$19 3.56,51.41 3.98,51.41
  Top 0.813: 17.81,28.17 Z1.1 | Z2.1 19.08,35.81 L1.2 18.07,36.02 15.78,38.3 15.78,43.72 9.86,49.64 U$1.P$3 | U$1.P$14 U$1.P$13 U$1.P$12 U$1.P$11 U$1.P$10 U$1.P$2
  Bottom 0.305: 4.39,51.41 U$1.P$6 | 4.39,51.41 U$1.P$22 | 4.39,51.41 4.39,51.36 | 8.86,49.89 U$1.P$16 | 9.67,49.89 U$1.P$3 | 9.67,49.89 U$1.P$4 | 9.67,49.89 U$1.P$1 9.06,49.89 U$1.P$9 8.76,49.78 U$1.P$17 8.86,49.89 | 8.86,49.89 U$1.P$7 | U$1.P$8 9.27,49.89 U$1.P$7 | U$1.P$25 3.58,39.62 U$1.P$24 3.98,39.62 U$1.P$26 4.18,39.62 U$1.P$27 4.39,39.62 | 4.39,39.62 U$1.P$28 | 4.39,39.62 U$1.P$5 | U$1.P$7 8.66,49.38 8.66,48.36 6.22,45.92 6.22,44.81 8.66,42.37 8.66,41.55 U$1.P$14
  Bottom 0.813: U$1.P$5 U$1.P$26 U$1.P$27 U$1.P$28 7.53,39.66 U$1.P$13 | U$1.P$20 U$1.P$6 U$1.P$22 4.39,51.36 7.73,51.36 U$1.P$8 10.12,50.69
VBUS
  Top 0.305: 6.01,46.51 6.39,46.89 U$1.B9 8.79,46.89 | 6.01,44.51 6.14,44.39 U$1.B4 8.84,44.39 9.09,44.14 U$1.9 | 8.79,46.89 8.81,46.91 | U$1.4 9.04,46.64 8.79,46.89
  Top 0.508: U$1.9 10.89,44.14 11.01,44.01 12.01,43.01
  Top 0.61: 6.01,44.51 6.01,46.51 | F1.2 12.46,42.57 12.01,43.01
VUCAP
  Top 0.254: IC4.27 24.84,30.06 24.57,30.33
  Top 0.406: 24.57,30.33 24.27,30.63 24.27,31.67 C10.1
XT1
  Top 0.254: 25.82,23.85 R2.1 26.2,24.51 IC4.1
  Top 0.305: C14.1 24.14,20.8 Y2.2
  Top 0.406: C14.1 R2.1
XT2
  Top 0.254: IC4.2 26.7,24.46 R2.2 | C15.1 28.71,20.8 Y2.1
  Top 0.406: C15.1 R2.2
(copper drawn outside any net)
  shapes: Top area x2

### Text on the board
ReferenceLC: L | TX | RX
test-probe: ISP2_6 | ISP2_4 | ISP2_2 | ISP2_1 | ISP2_3 | ISP2_5 | USB1_D-